# EAGLE design USB-Iso (EAGLE 8.7.0)
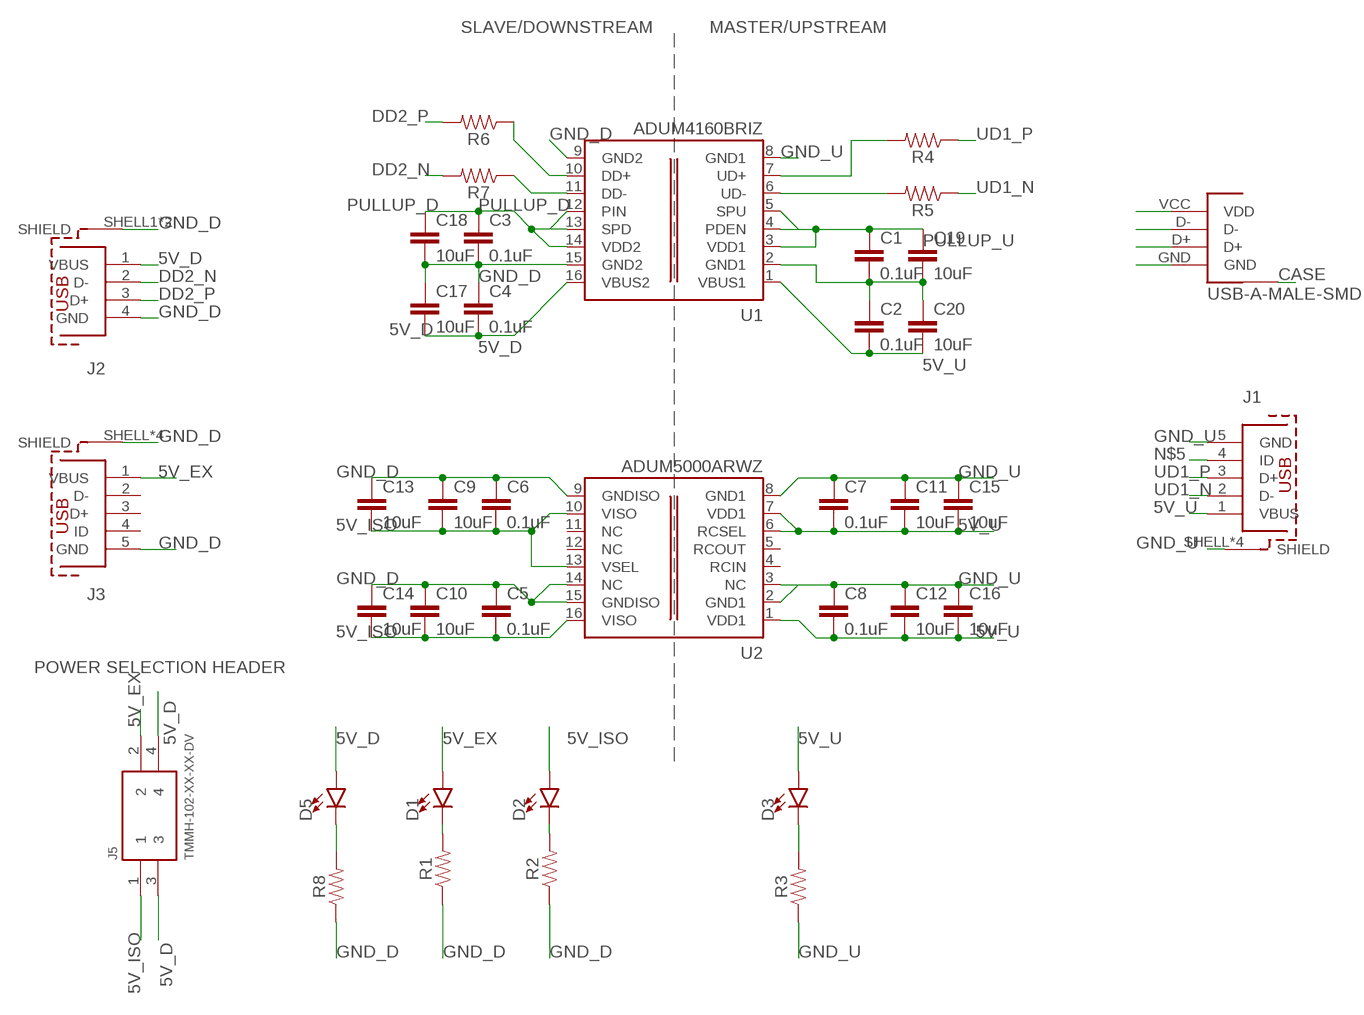
[diagram p0: schematic, sheet 1]

## Parts
C1  0.1uF  0.1UF-0603-100V-10%  [0603]
C2  0.1uF  0.1UF-0603-100V-10%  [0603]
C3  0.1uF  0.1UF-0603-100V-10%  [0603]
C4  0.1uF  0.1UF-0603-100V-10%  [0603]
C5  0.1uF  0.1UF-0603-100V-10%  [0603]
C6  0.1uF  0.1UF-0603-100V-10%  [0603]
C7  0.1uF  0.1UF-0603-100V-10%  [0603]
C8  0.1uF  0.1UF-0603-100V-10%  [0603]
C9  10uF  10UF-0603-6.3V-20%  [0603]
C10  10uF  10UF-0603-6.3V-20%  [0603]
C11  10uF  10UF-0603-6.3V-20%  [0603]
C12  10uF  10UF-0603-6.3V-20%  [0603]
C13  10uF  10UF-0603-6.3V-20%  [0603]
C14  10uF  10UF-0603-6.3V-20%  [0603]
C15  10uF  10UF-0603-6.3V-20%  [0603]
C16  10uF  10UF-0603-6.3V-20%  [0603]
C17  10uF  10UF-0603-6.3V-20%  [0603]
C18  10uF  10UF-0603-6.3V-20%  [0603]
C19  10uF  10UF-0603-6.3V-20%  [0603]
C20  10uF  10UF-0603-6.3V-20%  [0603]
D1  LED0603  [LED-0603]
D2  LED0603  [LED-0603]
D3  LED0603  [LED-0603]
D5  LED0603  [LED-0603]
J1  MICRO-USB-SOCKET  [629105136821]
J2  USB-A-FEMALE-SMD  [629104151021]
J3  MICRO-USB-SOCKET  [629105136821]
J4  USB-A-MALE-SMD  [USB-A-MALE-SMD]
J5  TMMH-102-XX-XX-DV  [TMMH-102-XX-XX-DV]
R1  RESISTOR0603  [0603]
R2  RESISTOR0603  [0603]
R3  RESISTOR0603  [0603]
R4  RESISTOR0603  [0603]
R5  RESISTOR0603  [0603]
R6  RESISTOR0603  [0603]
R7  RESISTOR0603  [0603]
R8  RESISTOR0603  [0603]
U1  ADUM4160BRIZ  [SO-16W]
U2  ADUM5000ARWZ  [SO-16W]

## Nets
5V_D: C4.2 C17.2 D5.A J2.1(VBUS) J5.3 J5.4 U1.16(VBUS2)
5V_EX: D1.A J3.1(VBUS) J5.2
5V_ISO: C5.2 C6.2 C9.2 C10.2 C13.2 C14.2 D2.A J5.1 U2.10(VISO) U2.13(VSEL) U2.16(VISO)
5V_U [power]: C2.2 C7.2 C8.2 C11.2 C12.2 C15.2 C16.2 C20.2 D3.A J1.1(VBUS) J4.VCC(VDD) U1.1(VBUS1) U2.1(VDD1) U2.6(RCSEL) U2.7(VDD1)
DD1_N [USB diff pairs]: R7.1 U1.11(DD-)
DD1_P [USB diff pairs]: R6.1 U1.10(DD+)
DD2_N [USB diff pairs]: J2.2(D-) R7.2
DD2_P [USB diff pairs]: J2.3(D+) R6.2
GND_D: C3.2 C4.1 C5.1 C6.1 C9.1 C10.1 C13.1 C14.1 C17.1 C18.2 J2.4(GND) J2.SHELL1(SHIELD) J2.SHELL2(SHIELD) J3.5(GND) J3.SHELL1(SHIELD) J3.SHELL2(SHIELD) J3.SHELL3(SHIELD) J3.SHELL(SHIELD) R1.1 R2.1 R8.1 U1.9(GND2) U1.15(GND2) U2.9(GNDISO) U2.14(NC) U2.15(GNDISO)
GND_U [power]: C1.2 C2.1 C7.1 C8.1 C11.1 C12.1 C15.1 C16.1 C19.2 C20.1 J1.5(GND) J1.SHELL1(SHIELD) J1.SHELL2(SHIELD) J1.SHELL3(SHIELD) J1.SHELL(SHIELD) J4.CASE1(CASE) J4.CASE2(CASE) J4.GND R3.1 U1.2(GND1) U1.8(GND1) U2.2(GND1) U2.3(NC) U2.8(GND1)
N$1: D5.C R8.2
N$3: D1.C R1.2
N$4: D2.C R2.2
N$5: J1.4(ID)
N$12: D3.C R3.2
PULLUP_D: C3.1 C18.1 U1.12(PIN) U1.13(SPD) U1.14(VDD2)
PULLUP_U: C1.1 C19.1 U1.3(VDD1) U1.4(PDEN) U1.5(SPU)
UD1_N [USB diff pairs]: J1.2(D-) J4.D- R5.1
UD1_P [USB diff pairs]: J1.3(D+) J4.D+ R4.1
UD2_N [USB diff pairs]: R5.2 U1.6(UD-)
UD2_P [USB diff pairs]: R4.2 U1.7(UD+)
Unconnected: J3.2(D-) J3.3(D+) J3.4(ID) U2.4(RCIN) U2.5(RCOUT) U2.11(NC) U2.12(NC)

## Notes on the sheet
- SLAVE/DOWNSTREAM | MASTER/UPSTREAM
- POWER SELECTION HEADER

## Library data of the parts
C1-C8 = SparkFun-Capacitors:0.1UF: 0.1µF ceramic capacitors A capacitor is a passive two-terminal electrical component used to store electrical energy temporarily in an electric field.; PROD_ID: CAP-08390
C9-C20 = SparkFun-Capacitors:10UF: 10.0µF ceramic capacitors A capacitor is a passive two-terminal electrical component used to store electrical energy temporarily in an electric field.; PROD_ID: CAP-11015
D1-D3 D5 = SparkFun-LED:LED: LED (Generic) Standard schematic elements and footprints for 5mm, 3mm, 1206, and 0603 sized LEDs. Generic LEDs with no color specified.
J1 J3 = USB-isolator:MICRO-USB-SOCKET: WR-COM SMT Horizontal 5 Contacts Micro USB Type B,5 pins=>Code : Con_I-O_COM_MicroUSB_629105136821 <http://katalog.we-online.de/media/images/eican/Con_I-O_COM_MicroUSB_629105136821_pf2.jpg> Details see: http://katalog.we-online.de/en/em/COM_MICRO_SMT_TYPE_B_HORIZONTAL/629105136821?m Created 2014-07-09, Karrer Zheng 2014 (C) Würth Elektronik
J2 = USB-isolator:USB-A-FEMALE-SMD: WR-COM_USB_Type A_Horizontal_SMT ; Type A Horizontal SMT - with Pegs - T&R Packaging Code : Con_I-O_COM_USB_2.0_A_629104151021_629104151021 <http://katalog.we-online.de/media/images/eican/Con_I-O_COM_USB_2.0_A_629104151021_pf2.jpg> Details see: http://katalog.we-online.de/em/datasheet/629104151021.pdf Created 12/08/2014, Dan Xu 2014 (C) Wurth Elektronik
J4 = USB-isolator:USB-A-MALE-SMD: Molex 48037-2100 USB-A-MALE-SMD
J5 = USB-isolator:TMMH-102-XX-XX-DV: 2mm (.0787") Flex Shroud, .020" (.51mm) Square Post Terminal Strip, Surface Mount,10 Pins.
R1-R8 = SparkFun-Resistors:RESISTOR: Generic Resistor Package; SPICEPREFIX: R
U1 = USB-isolator:ADUM4160BRIZ: Triple-Channel Digital Isolators Source: http://www.analog.com/static/imported-files/data_sheets/ADuM1300_1301.pdf; MPN: ADUM4160BRIZ
U2 = USB-isolator:ADUM5000ARWZ

## Net classes
0 default: clearance 0.205 mm
1 USB diff pairs: width 0.152 mm, clearance 0.203 mm to class 0, clearance 0.203 mm
2 power: width 0.406 mm, clearance 0.205 mm to class 0, clearance 0.205 mm to class 1, clearance 0.205 mm

## Board
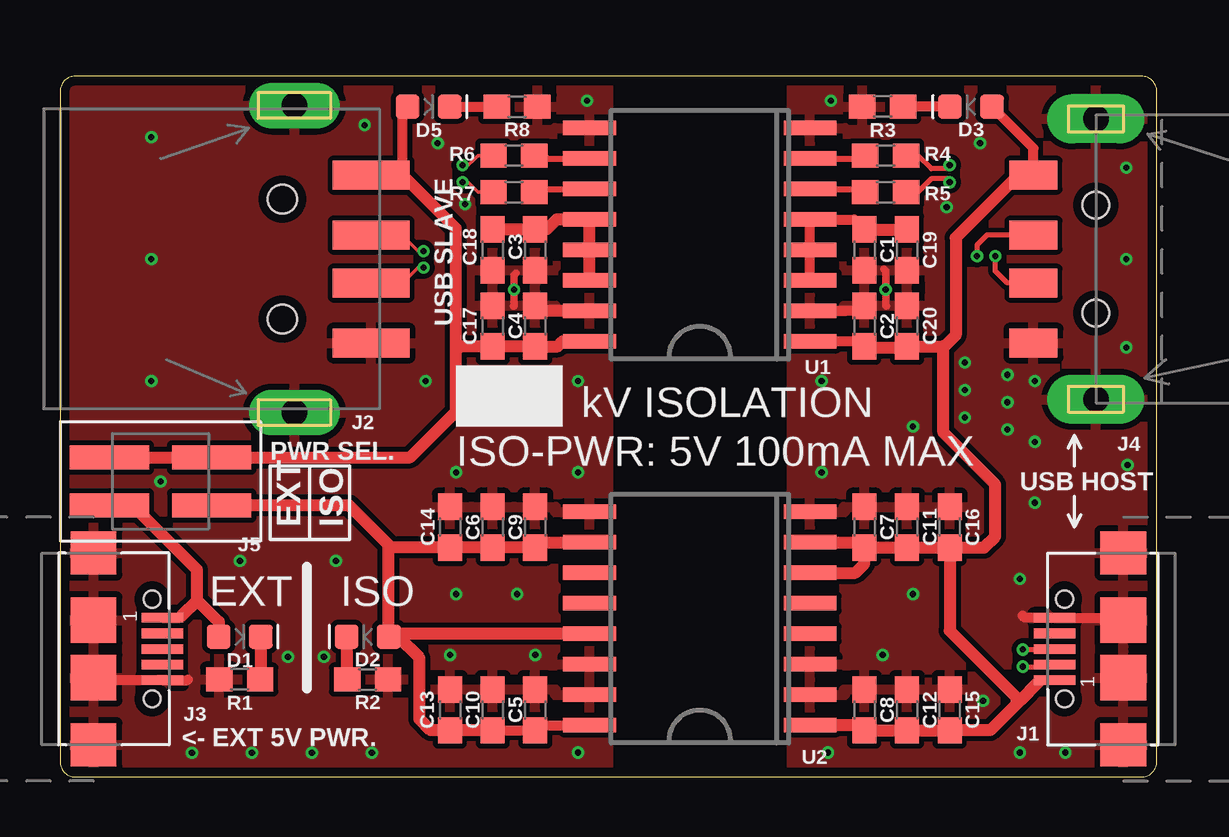
[diagram p1: board, top side]
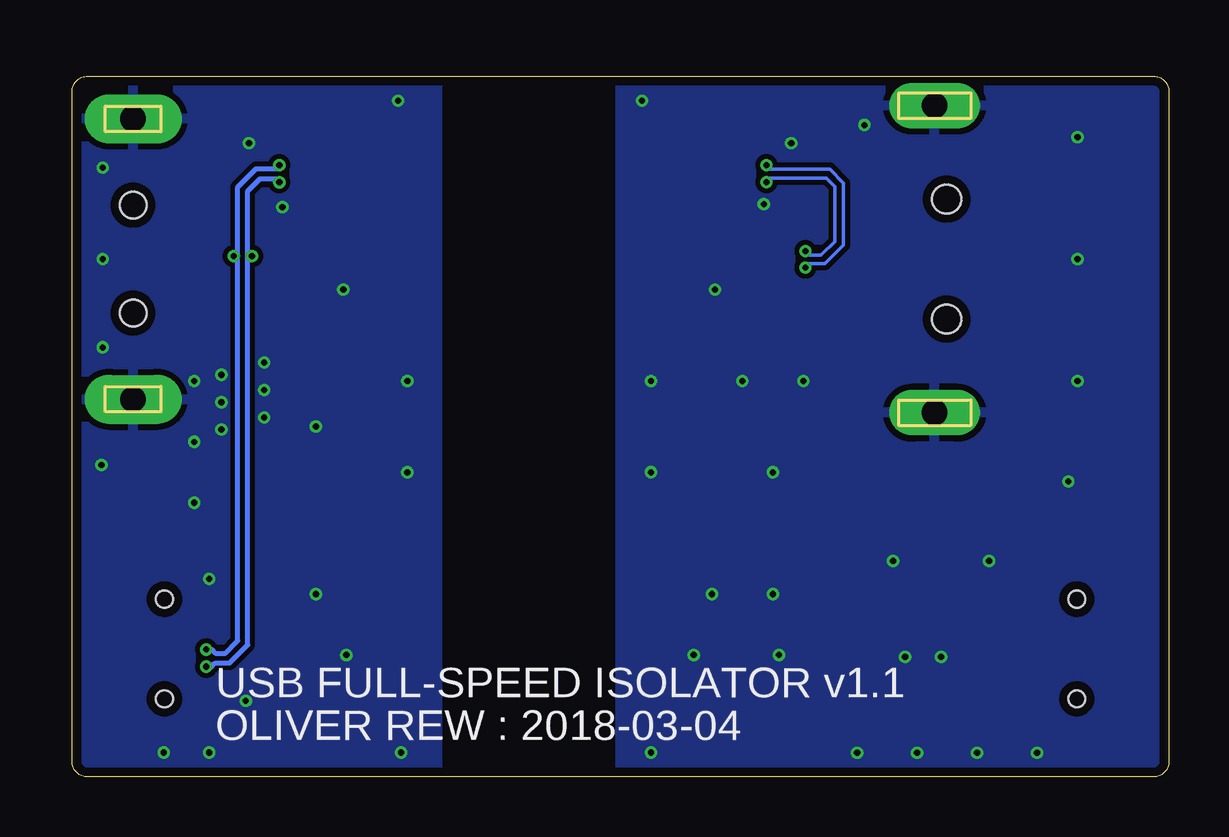
[diagram p2: board, bottom side, seen from below]

Size 45.72 x 29.21 mm. Coordinates in mm from the lower left corner, seen from the top.
Outline: 0.64,0 45.09,0 arc90 45.72,0.64 45.72,28.57 arc90 45.09,29.21 0.64,29.21 arc90 0,28.57 0,0.64 arc90 0.64,0
Copper layers (1*16): Top 0.035559375mm / dielectric 1.6mm / Bottom 0.035559375mm
Design rules "USB-Iso": minimum track width 6mil, minimum drill 10mil, track to track 0.205mm, track to pad 0.205mm, pad to pad 0.205mm, via to via 0.205mm, smd to smd 6mil, copper to edge 15mil, drill to drill 6mil, minimum pad ring 5mil, minimum via ring 5mil, stop-mask expansion 2.5mil, vias tented up to drill 20mil, thermal gap 10mil

### Footprints (pad centres in the part's own frame; a part is rotated, then mirrored left to right if it is on the bottom)
0603 = smd 1.1 x 1: 1 -0.85,0; 2 0.85,0
LED-0603 = smd 1 x 1: A -0.877,0; C 0.877,0
629105136821 = smd 0.4 x 1.731: 1 -1.3,2.865; 2 -0.65,2.865; 3 0,2.865; 4 0.65,2.865; 5 1.3,2.865 | smd 1.8 x 1.9: SHELL -4,0; SHELL3 4,0 | smd 1.9 x 1.9: SHELL1 -1.2,0; SHELL2 1.2,0 | hole 0.7: -2.075,2.45; 2.075,2.45
629104151021 = smd 1.2 x 3.2: 1 -3.5,3.7; 2 -1,3.7; 3 1,3.7; 4 3.5,3.7 | drill 1.067 pad 1.9 long: SHELL1 6.4,0.5; SHELL2 -6.4,0.5 | hole 1.2: -2.5,0; 2.5,0
USB-A-MALE-SMD = drill 1.067 pad 2.032 long: CASE1 -5.85,0; CASE2 5.85,0 | smd 1.2 x 2: D+ -1,2.6; D- 1,2.6; GND -3.5,2.6; VCC 3.5,2.6 | hole 1.1: -2.25,0; 2.25,0
TMMH-102-XX-XX-DV = smd 1.016 x 3.302: 1 -1,-2.134; 2 -1,2.134; 3 1,-2.134; 4 1,2.134
SO-16W = smd 0.6 x 2.2: 1 -4.445,-4.6; 2 -3.175,-4.6; 3 -1.905,-4.6; 4 -0.635,-4.6; 5 0.635,-4.6; 6 1.905,-4.6; 7 3.175,-4.6; 8 4.445,-4.6; 9 4.445,4.6; 10 3.175,4.6; 11 1.905,4.6; 12 0.635,4.6; 13 -0.635,4.6; 14 -1.905,4.6; 15 -3.175,4.6; 16 -4.445,4.6

### Placement (x,y rotation side)
C1  33.53,21.97 270 top
C2  33.53,18.8 270 top
C3  19.81,21.97 270 top
C4  19.81,18.8 270 top
C5  19.81,2.79 270 top
C6  18.03,10.41 270 top
C7  33.53,10.41 270 top
C8  33.53,2.79 270 top
C9  19.81,10.41 270 top
C10  18.03,2.79 270 top
C11  35.31,10.41 270 top
C12  35.31,2.79 270 top
C13  16.26,2.79 270 top
C14  16.26,10.41 270 top
C15  37.08,2.79 270 top
C16  37.08,10.41 270 top
C17  18.03,18.8 270 top
C18  18.03,21.97 270 top
C19  35.31,21.97 270 top
C20  35.31,18.8 270 top
D1  7.49,5.84 0 top
D2  12.83,5.84 180 top
D3  37.97,27.94 180 top
D5  15.37,27.94 0 top
J1  44.32,5.33 90 top
J2  9.27,21.59 270 top
J3  1.4,5.33 270 top
J4  43.18,21.59 90 top
J5  4.19,12.32 90 top
R1  7.49,4.06 0 top
R2  12.83,4.06 180 top
R3  34.29,27.94 0 top
R4  34.42,25.91 180 top
R5  34.42,24.38 180 top
R6  18.92,25.91 180 top
R7  18.92,24.38 180 top
R8  19.05,27.94 180 top
U1  26.67,22.61 90 top
U2  26.67,6.6 90 top

### Tracks (layer width: path | path; a pad name or v marks a point on that pad's centre or on a via)
5V_D
  Top 0.152: J5.3 6.35,13.32
  Top 0.406: 14.28,25.09 14.28,27.86 D5.A
  Top 0.508: 14.28,25.09 16.51,22.86 16.51,17.78 | U1.16 20.95,18.16 20.74,17.95 C4.2 C17.2 16.68,17.95 16.51,17.78 | 16.51,17.78 16.51,15.24 14.59,13.32 6.6,13.32 | J5.4 6.35,13.32 6.6,13.32 | 6.6,13.32 6.65,13.37
  Top 0.61: J2.1 14.28,25.09
5V_EX
  Top 0.406: J3.1 4.98,6.63 5.08,6.73
  Top 0.508: 5.08,6.73 5.71,7.37 | 5.71,7.37 5.71,8.64 3.17,11.18 2.58,11.18 J5.2 | 5.71,7.37 6.62,6.46 D1.A
5V_ISO
  Top 0.406: C9.2 20.03,9.78 | U2.16 20.03,2.16 C5.2 C10.2
  Top 0.508: 20.03,9.78 U2.10 | C9.2 C6.2 C14.2 13.8,9.56 13.7,9.66 | C10.2 C13.2 15.46,1.94 14.99,2.41 14.99,4.95 14.1,5.84 D2.A | U2.13 13.83,5.97 D2.A | D2.A 13.7,9.66 | J5.1 12.05,11.32 13.7,9.66
5V_U
  Top 0.406: U1.1 33.31,18.16 C2.2 | C8.2 33.31,2.16 | 33.31,9.78 C7.2 | J1.1 40.86,4.03 40.77,3.94 | J4.VCC 40.58,26.21 D3.A
  Top 0.508: U2.7 33.31,9.78 | U2.6 33.15,8.51 33.53,8.89 C7.2 C11.2 C16.2 | 36.83,17.91 37.34,18.41 37.34,22.48 39.95,25.09 J4.VCC | 33.57,17.91 35.27,17.91 C20.2 36.79,17.95 36.83,17.91 | 33.31,2.16 U2.1 | C8.2 C12.2 C15.2 38.77,1.94 40.01,3.17 | C16.2 38.52,9.56 38.99,10.03 38.99,12.19 36.83,14.35 36.83,17.91 | 40.77,3.94 40.01,3.17 | 40.01,3.17 39.88,3.17 | C16.2 37.08,6.1 40.01,3.17
  Top 0.61: C2.2 33.57,17.91
DD1_N
  Top 0.254: R7.1 19.9,24.51 U1.11
DD1_P
  Top 0.254: R6.1 20.19,25.91 20.32,25.78 U1.10
DD2_N  (via drill 0.25)
  Top 0.152: R7.2 17.44,24.38 16.85,24.97 v16.78,24.79 | J2.2 14.25,22.59 15.09,21.75 v15.16,21.92
  Bottom 0.152: v16.78,24.79 16.85,24.97 14.29,24.97 13.93,24.61 13.93,22.32 14.5,21.75 15.09,21.75 v15.16,21.92
DD2_P  (via drill 0.25)
  Top 0.152: R6.2 17.43,25.91 16.85,25.33 v16.78,25.51 | J2.3 14.28,20.59 15.09,21.4 v15.16,21.23
  Bottom 0.152: v16.78,25.51 16.85,25.33 14.14,25.33 13.57,24.76 13.57,22.18 14.35,21.4 15.09,21.4 v15.16,21.23
GND_D  (via drill 0.25)
  Top 0.305: 19,21 18.92,20.92 v18.92,20.32 18.92,19.64 18.91,19.62
  Top 0.406: J3.5 4.73,4.03 | J3.5 1.5,4.03 J3.SHELL2 | J3.5 5.3,4.03 5.33,4.06 | 19.6,19.65 C4.1 | 18.25,19.65 C17.1
  Top 0.508: U1.15 20.03,19.43 C4.1
  other vias: 17.78,16.51 4.19,12.32 5.5,1 12.7,27.18 21.97,28.19 13,1 3.81,16.51 3.81,21.59 3.81,26.67 7.5,9 15.75,26.42 15.24,16.51 19.81,5.08 16.26,5.08 16.51,7.62 19.05,7.62 10.5,1 21.59,1.02 8,1 16.51,12.7 16.89,23.88 21.59,16.51 21.59,12.7 11.5,9 11,5 9.5,5
  pour Top: 0,29.21 0,0 22.86,0 22.86,29.21
  pour Bottom: 0,29.21 0,0 22.86,0 22.86,29.21
GND_U  (via drill 0.25)
  Top 0.305: 34.34,21.18 34.42,21.1 v34.42,20.32 34.42,19.64 34.44,19.62
  Top 0.406: U1.2 33.31,19.43 C2.1 33.74,19.65 | 40.13,6.73 40.23,6.63 J1.5 44.22,6.63 J1.SHELL2 | 35.09,19.65 C20.1
  other vias: 37.72,17.27 34.29,5.08 41.91,1.02 35.56,14.61 40.64,16.51 31.75,12.7 35.56,7.62 40.01,8.26 44.45,21.59 32.13,28.19 32,1.02 31.75,16.51 40.64,11.43 44.45,17.91 44.45,25.4 38.35,26.42 40.64,13.97 44.5,13 40.01,1.02 37.72,16.13 38.48,3.17 36.96,23.75 39.5,14.48 39.5,15.62 39.5,16.76 37.72,14.99
  pour Bottom: 45.72,29.21 45.72,0 30.48,0 30.48,29.21
  pour Top: 30.48,29.21 30.48,0 45.72,0 45.72,29.21
N$1
  Top 0.406: D5.C R8.2
N$3
  Top 0.508: D1.C 8.37,4.09 R1.2
N$4
  Top 0.508: D2.C 11.95,4.09 R2.2
N$12
  Top 0.406: D3.C R3.2
PULLUP_D
  Top 0.508: U1.14 U1.12 | U1.13 U1.12 | U1.12 20.7,23.24 20.28,22.82 C3.1 C18.1
PULLUP_U
  Top 0.406: U1.3 U1.4 U1.5 33.11,23.24 C1.1
  Top 0.508: C1.1 C19.1
UD1_N  (via drill 0.25)
  Top 0.203: v37.08,24.79 37.08,24.94 36.32,24.94 35.76,24.38 R5.1 | J4.D- 38.64,22.59 38.23,22.18 v38.23,21.72 | v40.13,4.6 41.37,4.6 J1.2
  Bottom 0.203: v40.13,4.6 39.9,4.6 39.75,4.75 39.16,4.75 38.4,5.5 38.4,21.72 | 38.4,21.72 38.4,24.43 37.89,24.94 37.24,24.94 v37.08,24.79 | v38.23,21.72 38.4,21.72
UD1_P  (via drill 0.25)
  Top 0.203: v37.08,25.5 37.08,25.35 36.32,25.35 35.76,25.91 R4.1 | J4.D+ 39.48,20.59 38.99,21.08 v38.99,21.72 | v40.13,5.31 41.43,5.31 J1.3
  Bottom 0.203: v40.13,5.31 39.9,5.31 39.75,5.16 39.33,5.16 38.81,5.67 38.81,21.72 | 38.81,21.72 38.81,24.6 38.06,25.35 37.24,25.35 v37.08,25.5 | v38.99,21.72 38.81,21.72
UD2_N
  Top 0.254: U1.6 33.44,24.51 R5.2
UD2_P
  Top 0.254: U1.7 33.44,25.78 R4.2

### Text on the board
tPlace: USB SLAVE | kV ISOLATION | PWR SEL. | ISO-PWR: 5V 100mA MAX | USB HOST | EXT | ISO | EXT | ISO | <- EXT 5V PWR.
bPlace: USB FULL-SPEED ISOLATOR v1.1 | OLIVER REW : 2018-03-04